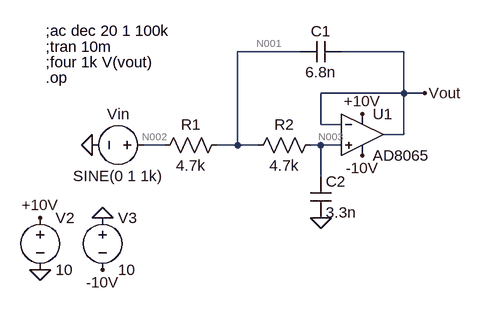
[diagram p0: schematic Etaj2.asc]
Etaj2.asc, the LTspice schematic file:
Version 4.1
SHEET 1 880 680
WIRE 256 -32 160 -32
WIRE 416 -32 320 -32
WIRE 416 32 416 -32
WIRE 416 32 288 32
WIRE 448 32 416 32
WIRE 288 80 288 32
WIRE 320 80 288 80
WIRE 416 96 416 32
WIRE 416 96 384 96
WIRE 48 112 16 112
WIRE 160 112 160 -32
WIRE 160 112 128 112
WIRE 192 112 160 112
WIRE 288 112 272 112
WIRE 320 112 288 112
WIRE 288 160 288 112
FLAG 288 224 0
FLAG 448 32 Vout
FLAG -64 112 0
FLAG -144 304 0
FLAG -48 224 0
FLAG -144 224 +10V
FLAG 352 64 +10V
FLAG -48 304 -10V
FLAG 352 128 -10V
SYMBOL voltage 32 112 R90
WINDOW 0 -32 56 VBottom 2
WINDOW 3 32 56 VTop 2
WINDOW 123 60 56 VTop 2
WINDOW 39 0 0 Left 0
SYMATTR InstName Vin
SYMATTR Value SINE(0 1 1k)
SYMBOL res 144 96 R90
WINDOW 0 0 56 VBottom 2
WINDOW 3 32 56 VTop 2
SYMATTR InstName R1
SYMATTR Value 4.7k
SYMBOL res 288 96 R90
WINDOW 0 0 56 VBottom 2
WINDOW 3 32 56 VTop 2
SYMATTR InstName R2
SYMATTR Value 4.7k
SYMBOL OpAmps\\AD8065 352 32 R0
SYMATTR InstName U1
SYMBOL cap 272 160 R0
SYMATTR InstName C2
SYMATTR Value 3.3n
SYMBOL cap 320 -48 R90
WINDOW 0 0 32 VBottom 2
WINDOW 3 32 32 VTop 2
SYMATTR InstName C1
SYMATTR Value 6.8n
SYMBOL voltage -144 208 R0
WINDOW 123 0 0 Left 0
WINDOW 39 0 0 Left 0
SYMATTR InstName V2
SYMATTR Value 10
SYMBOL voltage -48 208 R0
WINDOW 123 0 0 Left 0
WINDOW 39 0 0 Left 0
SYMATTR InstName V3
SYMATTR Value 10
TEXT -136 -64 Left 2 !;ac dec 20 1 100k
TEXT -136 -40 Left 2 !;tran 10m
TEXT -136 -16 Left 2 !;four 1k V(vout)
TEXT -136 8 Left 2 !.op

The netlist it stands for:
* Etaj2.asc
Vin N002 0 SINE(0 1 1k)
R1 N001 N002 4.7k
R2 N003 N001 4.7k
X§U1 N003 Vout +10V -10V Vout AD8065  ; pins In+ In- V+ V- OUT
C2 N003 0 3.3n
C1 Vout N001 6.8n
V2 +10V 0 10
V3 0 -10V 10
;ac dec 20 1 100k
;tran 10m
;four 1k V(vout)
.op
.backanno
.end

* Results of the author's LTspice run, read from the files saved beside the schematic
* Operating Point:
*   V(n001) = -9.398 nV
*   V(vout) = 400 µV
*   V(+10v) = 10 V
*   V(n002) = 0 V
*   V(n003) = -18.8 nV
*   V(-10v) = -10 V
*   I(R2) = -2 pA
*   I(Vin) = -2 pA
*   I(C2) = 0 A
*   I(V2) = -6.4 mA
*   I(R1) = -2 pA
*   I(C1) = 0 A
*   I(V3) = -6.4 mA
*   Ix(u1:1) = 2 pA
*   Ix(u1:2) = 1.001 pA
*   Ix(u1:3) = 6.4 mA
*   Ix(u1:4) = -6.4 mA
*   Ix(u1:5) = -1.001 pA